# EAGLE design ArdSensor (EAGLE 7.1.0)
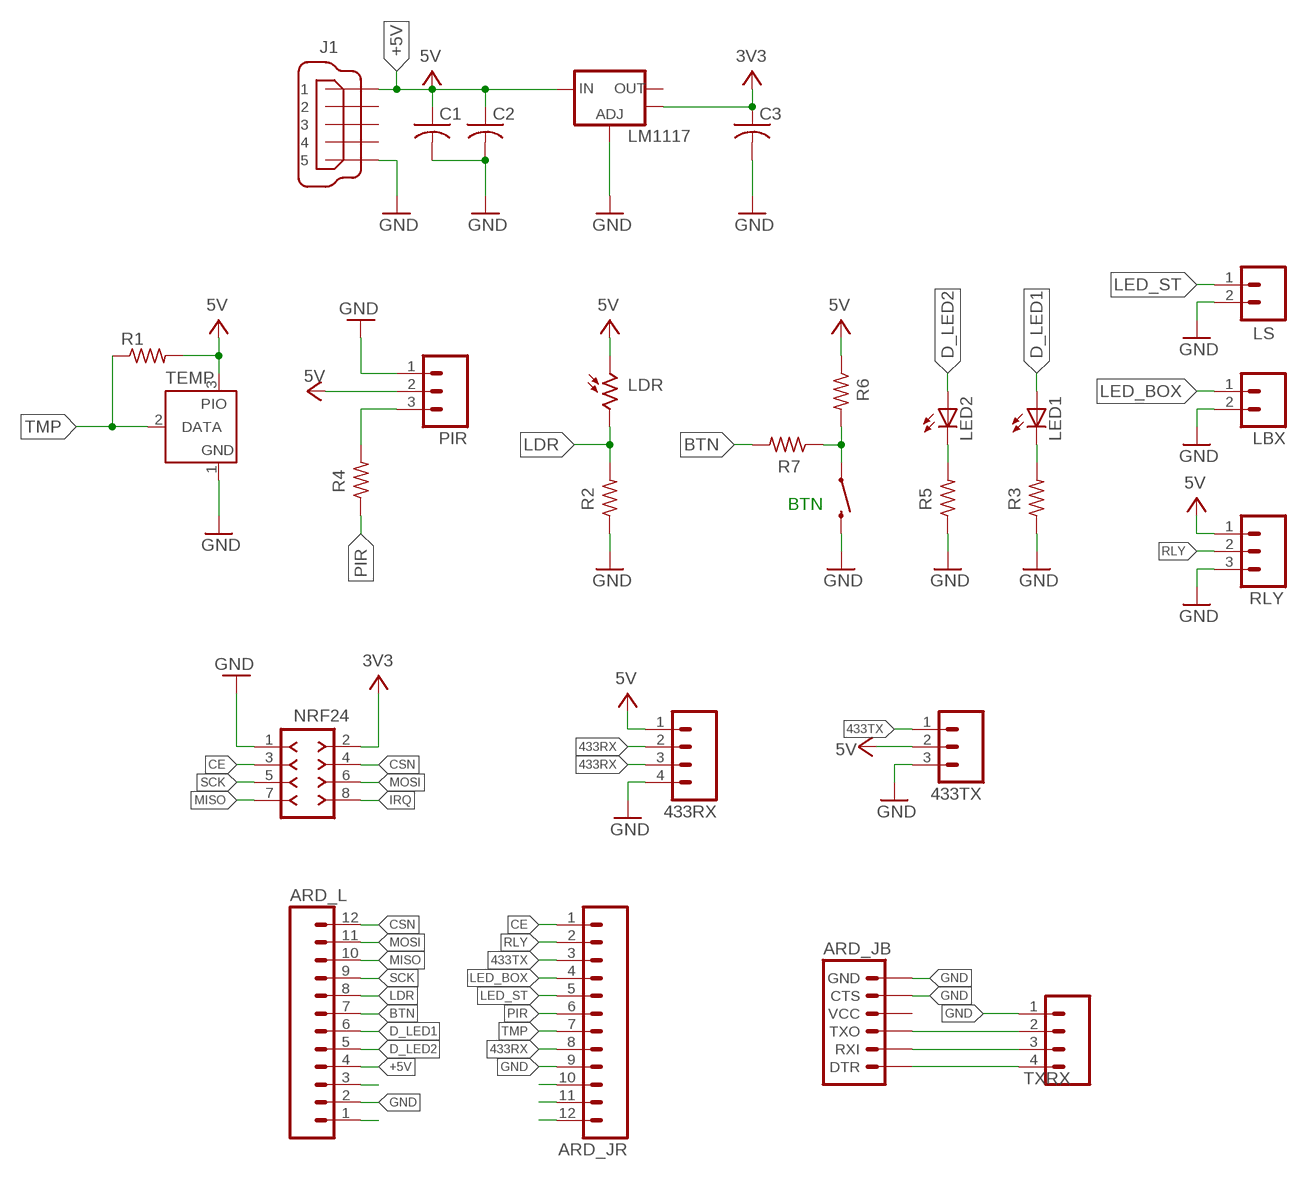
[diagram p0: schematic, sheet 1]

## Parts
433RX  M04PTH  [1X04]
433TX  M03PTH  [1X03]
ARD_JB  ARDUINO_SERIAL_PROGRAMPTH  [1X06]
ARD_JR  M12PTH  [1X12]
ARD_L  M12PTH  [1X12]
BTN  SWITCH-MOMENTARY-2SMD-1101NE  [TACTILE-SWITCH-1101NE]
C1  C-USC0805  [C0805]
C2  C-USC0805  [C0805]
C3  C-USC0805  [C0805]
J1  MICRO-USB-ZX62R-B-5P  [ZX62R-B-5P]
LBX  M02PTH  [1X02]
LDR  D11  [BPX65]
LED1  LEDCHIPLED_0805  [CHIPLED_0805]
LED2  LEDCHIPLED_0805  [CHIPLED_0805]
LM1117  V_REG_LM1117SOT223  [SOT223]
LS  M02PTH  [1X02]
NRF24  F-2X04-DIL-100  [DIL-100-2X04]
PIR  M03PTH  [1X03]
R1  R-US_R0805  [R0805]
R2  R-US_R0805  [R0805]
R3  R-US_R0805  [R0805]
R4  R-US_R0805  [R0805]
R5  R-US_R0805  [R0805]
R6  R-US_R0805  [R0805]
R7  R-US_R0805  [R0805]
RLY  M03PTH  [1X03]
TEMP  DS2405  [TO92-]
TXRX  M04PTH  [1X04]

## Nets
433RX: 433RX.2 433RX.3 ARD_JR.8
433TX: 433TX.1 ARD_JR.3
+3V3: C3.1 LM1117.4(OUT) NRF24.2 ; supply symbol labelled 3V3
+5V: 433RX.1 433TX.2 ARD_L.4 C1.1 C2.1 J1.1 LDR.A LM1117.3(IN) PIR.2 R1.2 R6.1 RLY.1 TEMP.3(PIO) ; supply symbol labelled 5V
BTN: ARD_L.7 R7.2
CE: ARD_JR.1 NRF24.3
CSN: ARD_L.12 NRF24.4
D_LED1: ARD_L.6 LED1.A
D_LED2: ARD_L.5 LED2.A
GND: 433RX.4 433TX.3 ARD_JB.5(CTS) ARD_JB.6(GND) ARD_JR.9 ARD_L.2 BTN.2 C1.2 C2.2 C3.2 J1.5 LBX.2 LM1117.1(ADJ) LS.2 NRF24.1 PIR.1 R2.1 R3.1 R5.1 RLY.3 TEMP.1(GND) TXRX.1
IRQ: NRF24.8
LDR: ARD_L.8 LDR.K R2.2
LED_BOX: ARD_JR.4 LBX.1
LED_ST: ARD_JR.5 LS.1
MISO: ARD_L.10 NRF24.7
MOSI: ARD_L.11 NRF24.6
N$2: LED2.C R5.2
N$3: LED1.C R3.2
N$5: PIR.3 R4.2
N$8: BTN.1 R6.2 R7.1
N$9: ARD_JB.3(TXO) TXRX.2
N$11: ARD_JB.2(RXI) TXRX.3
N$13: ARD_JB.1(DTR) TXRX.4
N$15: ARD_JR.10
N$16: ARD_JR.11
N$17: ARD_JR.12
N$49: ARD_L.3
N$51: ARD_L.1
PIR: ARD_JR.6 R4.1
RLY: ARD_JR.2 RLY.2
SCK: ARD_L.9 NRF24.5
TMP: ARD_JR.7 R1.1 TEMP.2(DATA)
Unconnected: ARD_JB.4(VCC) J1.2 J1.3 J1.4 LM1117.2(OUT)

## Library data of the parts
433RX TXRX = SparkFun-Connectors:M04: Header 4 Standard 4-pin 0.1" header. Use with straight break away headers (SKU : PRT-00116), right angle break away headers (PRT-00553), swiss pins (PRT-00743), machine pins (PRT-00117), and female headers (PRT-00115). Molex polarized connector foot print use with SKU : PRT-08231 with associated crimp pins and housings. 1MM SMD Version SKU: PRT-10208
433TX PIR RLY = SparkFun-Connectors:M03: Header 3 Standard 3-pin 0.1" header. Use with straight break away headers (SKU : PRT-00116), right angle break away headers (PRT-00553), swiss pins (PRT-00743), machine pins (PRT-00117), and female headers (PRT-00115). Molex polarized connector foot print use with SKU : PRT-08232 with associated crimp pins and housings.
ARD_JB = SparkFun-Connectors:ARDUINO_SERIAL_PROGRAM: FTDI connector footprints
ARD_JR ARD_L = SparkFun-Connectors:M12: Header 12 Standard 12-pin 0.1" header. Use with straight break away headers (SKU : PRT-00116), right angle break away headers (PRT-00553), swiss pins (PRT-00743), machine pins (PRT-00117), and female headers (PRT-00115).
BTN = sparkFun-Electromechanical:SWITCH-MOMENTARY-2: Various NO switches- pushbuttons, reed, etc; PROD_ID: SWCH-00815
C1-C3 = adafruit:C-US: CAPACITOR, American symbol
J1 = con-hirose2:MICRO-USB-: Hirose Micro USB Connector ZX62R-B-5P: Micro B, reverse (top mount) shell SMT Supplier: DigiKey H11574CT-ND Source: http://www.hirose.co.jp/cataloge_hp/e24200011.pdf
LBX LS = SparkFun-Connectors:M02: Standard 2-pin 0.1" header. Use with - straight break away headers ( PRT-00116) - right angle break away headers (PRT-00553) - swiss pins (PRT-00743) - machine pins (PRT-00117) - female headers (PRT-00115) Molex polarized connector foot print use with: PRT-08233 with associated crimp pins and housings. 2.54_SCREWTERM for use with PRT-10571. 3.5mm Screw Terminal footprints for PRT-08084 5mm Screw Terminal footprints for use with PRT-08432
LDR = APC:D11: Photo Sensor Oil Burner Control Applications Source: http://optoelectronics.perkinelmer.com/content/Datasheets/DTS_PhotocellsD1160.pdf
LED1 LED2 = led:LED: LED OSRAM: - CHIPLED LG R971, LG N971, LY N971, LG Q971, LY Q971, LO R971, LY R971 LH N974, LH R974 LS Q976, LO Q976, LY Q976 LO Q996 - Hyper CHIPLED LW Q18S LB Q993, LB Q99A, LB R99A - SideLED LS A670, LO A670, LY A670, LG A670, LP A670 LB A673, LV A673, LT A673, LW A673 LH A674 LY A675 LS A676, LA A676, LO A676, LY A676, LW A676 LS A679, LY A679, LG A679 - Hyper Micro SIDELED® LS Y876, LA Y876, LO Y876, LY Y876 LT Y87S - SmartLED LW L88C, LW L88S LB L89C, LB L89S, LG L890 LS L89K, LO L89K, LY L89K LS L896, LA L896, LO L896, LY L896 - TOPLED LS T670, LO T670, LY T670, LG T670, LP T670 LSG T670, LSP T670, LSY T670, LOP T670, LYG T670 LG T671, LOG T671, LSG T671 LB T673, LV T673, LT T673, LW T673 LH T674 LS T676, LA T676, LO T676, LY T676, LB T676, LH T676, LSB T676, LW T676 LB T67C, LV T67C, LT T67C, LS T67K, LO T67K, LY T67K, LW E67C LS E67B, LA E67B, LO E67B, LY E67B, LB E67C, LV E67C, LT E67C LW T67C LS T679, LY T679, LG T679 LS T770, LO T770, LY T770, LG T770, LP T770 LB T773, LV T773, LT T773, LW T773 LH T774 LS E675, LA E675, LY E675, LS T675 LS T776, LA T776, LO T776, LY T776, LB T776 LHGB T686 LT T68C, LB T68C - Hyper Mini TOPLED® LB M676 - Mini TOPLED Santana® LG M470 LS M47K, LO M47K, LY M47K Source: http://www.osram.convergy.de LUXEON: - LUMILED® LXK2-PW12-R00, LXK2-PW12-S00, LXK2-PW14-U00, LXK2-PW14-V00 LXK2-PM12-R00, LXK2-PM12-S00, LXK2-PM14-U00 LXK2-PE12-Q00, LXK2-PE12-R00, LXK2-PE12-S00, LXK2-PE14-T00, LXK2-PE14-U00 LXK2-PB12-K00, LXK2-PB12-L00, LXK2-PB12-M00, LXK2-PB14-N00, LXK2-PB14-P00, LXK2-PB14-Q00 LXK2-PR12-L00, LXK2-PR12-M00, LXK2-PR14-Q00, LXK2-PR14-R00 LXK2-PD12-Q00, LXK2-PD12-R00, LXK2-PD12-S00 LXK2-PH12-R00, LXK2-PH12-S00 LXK2-PL12-P00, LXK2-PL12-Q00, LXK2-PL12-R00 Source: www.luxeon.com KINGBRIGHT: KA-3528ASYC Source: www.kingbright.com
LM1117 = SparkFun-PowerIC:V_REG_LM1117: Voltage Regulator LM1117 Standard adjustable voltage regulator but in SMD form. Spark Fun Electronics SKU : COM-00595; PROD_ID: VREG-08170
NRF24 = con-headers-jp:F-2X04-: FEMALE HEADER
R1-R7 = resistor:R-US_: RESISTOR, American symbol
TEMP = maxim:DS2405: Addressable Switch DALLAS Semiconductor; MF: DALLAS SEMICONDUCTOR; MPN: DS2405; OC_FARNELL: 1188025; OC_NEWARK: 06F4645

## Board
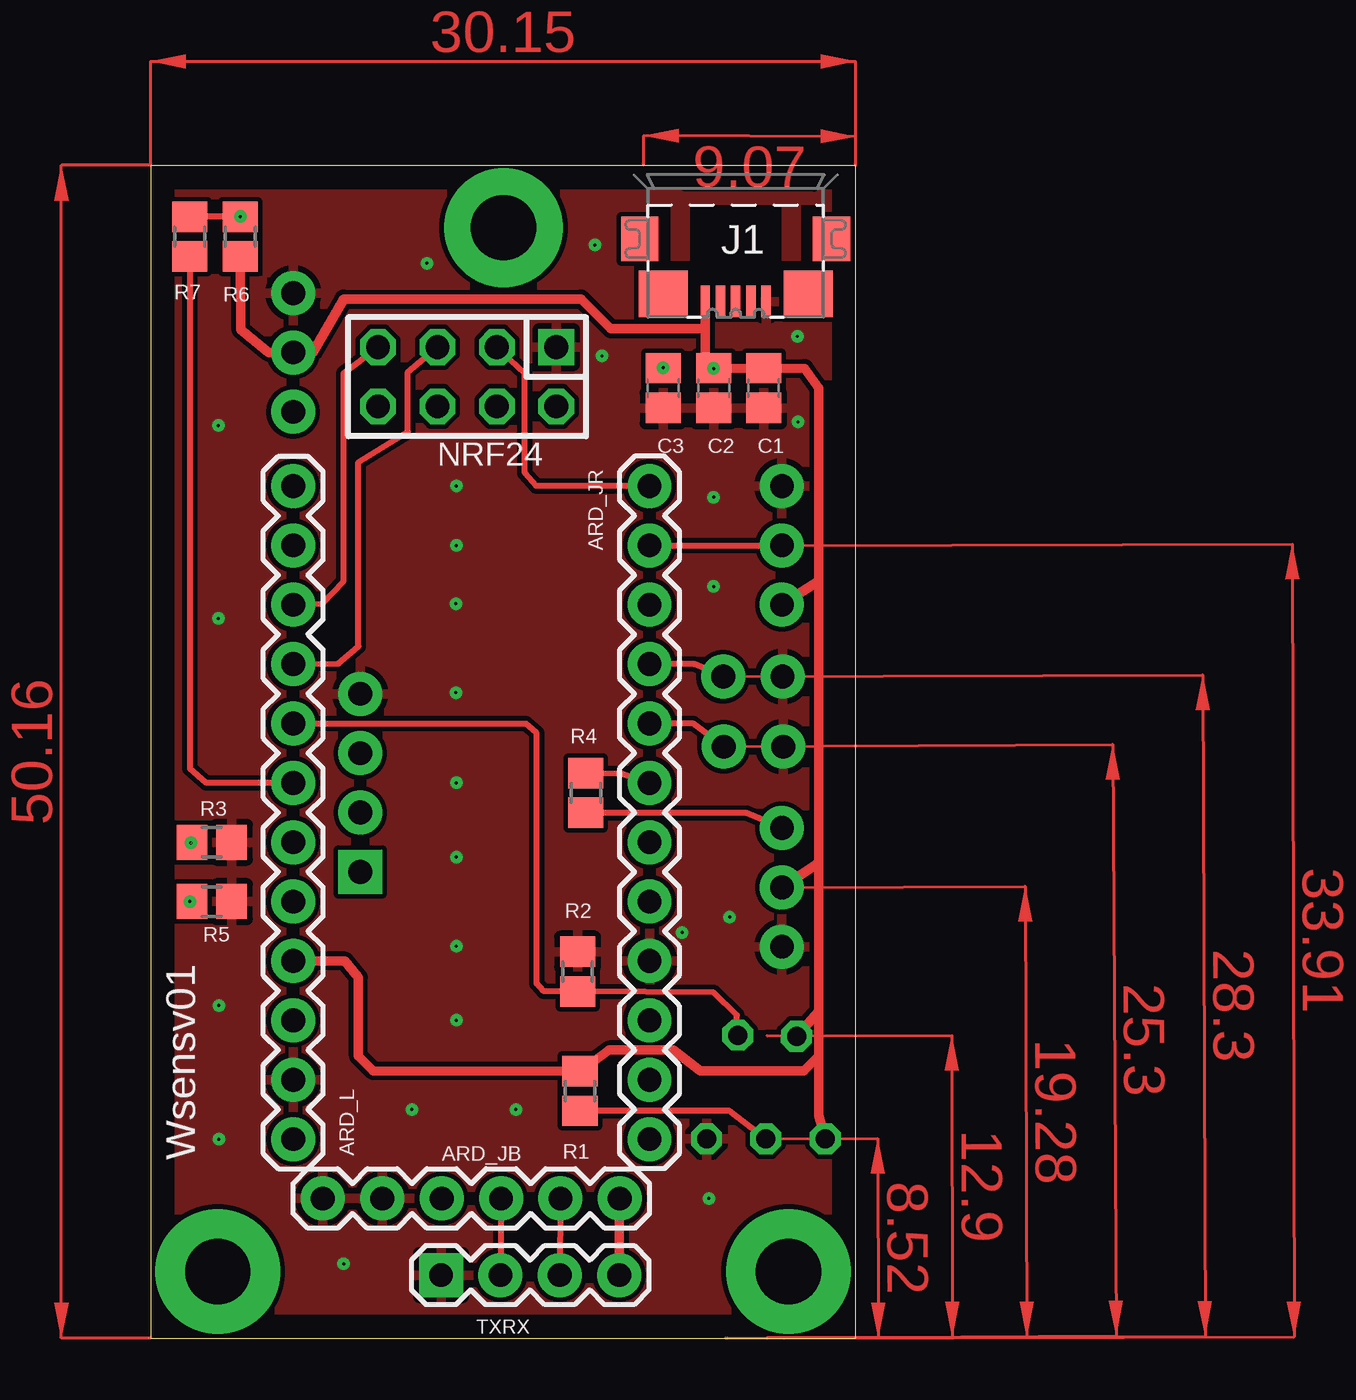
[diagram p1: board, top side]
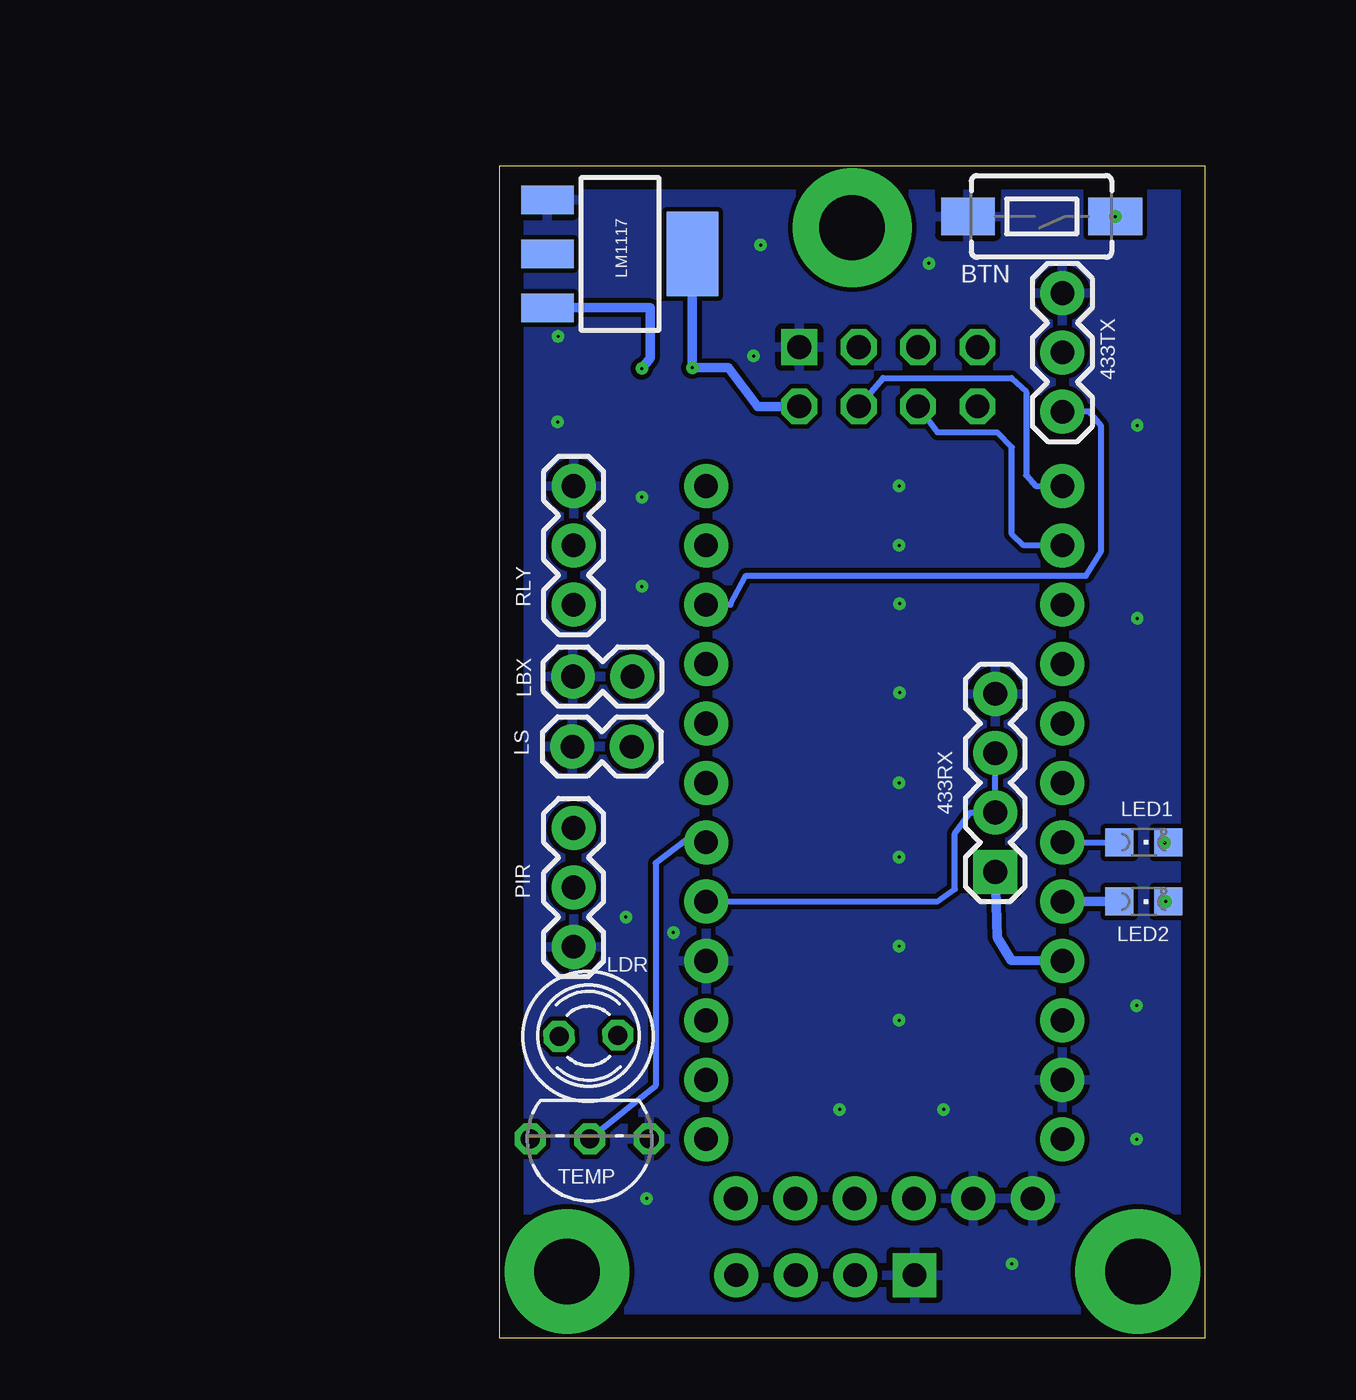
[diagram p2: board, bottom side, seen from below]

Size 30.15 x 50.16 mm. Coordinates in mm from the lower left corner, seen from the top.
Outline: 0,0 30.15,0 30.15,50.16 0,50.16 0,0
Copper layers (1*16): Top 0.035mm / dielectric 1.5mm / Bottom 0.035mm
Design rules "default": minimum track width 10mil, minimum drill 24mil, track to track 8mil, track to pad 8mil, pad to pad 8mil, via to via 8mil, smd to smd 8mil, copper to edge 40mil, drill to drill 8mil, minimum pad ring 10mil, minimum via ring 8mil, stop-mask expansion 4mil, vias tented up to drill 0mil, thermal gap 10mil

### Footprints (pad centres in the part's own frame; a part is rotated, then mirrored left to right if it is on the bottom)
1X04 = drill 1.016 pad 1.88 square: 1 0,0 | drill 1.016 pad 1.88: 2 2.54,0; 3 5.08,0; 4 7.62,0
1X03 = drill 1.016 pad 1.88: 1 0,0; 2 2.54,0; 3 5.08,0
1X06 = drill 1.016 pad 1.88: 1 0,0; 2 2.54,0; 3 5.08,0; 4 7.62,0; 5 10.16,0; 6 12.7,0
1X12 = drill 1.016 pad 1.88: 1 0,0; 2 2.54,0; 3 5.08,0; 4 7.62,0; 5 10.16,0; 6 12.7,0; 7 15.24,0; 8 17.78,0; 9 20.32,0; 10 22.86,0; 11 25.4,0; 12 27.94,0
TACTILE-SWITCH-1101NE = smd 2.3 x 1.6: 1 -3.15,0; 2 3.15,0
C0805 = smd 1.3 x 1.5: 1 -0.85,0; 2 0.85,0
ZX62R-B-5P = smd 1.35 x 0.4: 1 2.675,-1.3; 2 2.675,-0.65; 3 2.675,0; 4 2.675,0.65; 5 2.675,1.3 | smd 1.9 x 1.6: M1 0,-4.1; M2 0,4.1 | smd 2 x 2.1: M3 2.35,3.1; M4 2.35,-3.1
1X02 = drill 1.016 pad 1.88: 1 0,0; 2 2.54,0
BPX65 = drill 0.813 octagon: A -0.889,-0.889; K 0.889,0.889
CHIPLED_0805 = smd 1.2 x 1.2: A 0,-1.05; C 0,1.05
SOT223 = smd 1.219 x 2.235: 1 -2.311,-3.099; 2 0,-3.099; 3 2.311,-3.099 | smd 3.6 x 2.2: 4 0,3.099
DIL-100-2X04 = drill 1.016 square: 1 -3.81,-1.27 | drill 1.016 octagon: 2 -3.81,1.27; 3 -1.27,-1.27; 4 -1.27,1.27; 5 1.27,-1.27; 6 1.27,1.27; 7 3.81,-1.27; 8 3.81,1.27
R0805 = smd 1.3 x 1.5: 1 -0.85,0; 2 0.85,0
TO92- = drill 0.813 octagon: 1 -2.54,0; 2 0,0; 3 2.54,0

### Placement (x,y rotation side)
433RX  8.97,19.94 90 bottom
433TX  6.1,39.62 90 bottom
ARD_JB  20.07,5.97 180 top
ARD_JR  21.34,36.45 270 top
ARD_L  6.1,8.51 90 top
BTN  6.99,47.98 180 bottom
C1  26.21,40.64 270 top
C2  24.08,40.64 270 top
C3  21.92,40.64 270 top
J1  25.02,47.02 270 top
LBX  24.49,28.3 180 bottom
LDR  26.37,12.93 316 bottom
LED1  2.62,21.21 270 bottom
LED2  2.62,18.67 270 bottom
LM1117  25.02,46.38 270 bottom
LS  24.51,25.3 180 bottom
NRF24  13.54,41.12 180 top
PIR  27,16.74 90 bottom
R1  18.36,10.57 90 top
R2  18.26,15.67 270 top
R3  2.62,21.21 180 top
R4  18.62,23.32 270 top
R5  2.62,18.67 180 top
R6  3.84,47.12 90 top
R7  1.68,47.12 270 top
RLY  27,31.37 90 bottom
TEMP  26.31,8.52 180 bottom
TXRX  12.42,2.69 0 top

### Tracks (layer width: path | path; a pad name or v marks a point on that pad's centre or on a via)
433RX
  Bottom 0.254: ARD_JR.8 11.46,18.67 10.69,19.2 10.69,21.59 10.03,22.48 433RX.2 433RX.3
433TX
  Bottom 0.254: ARD_JR.3 20.3,31.37 19.63,32.61 5.08,32.61 4.45,33.66 4.45,39.01 4.95,39.62 433TX.1
+3V3  (via drill 0.13 pad 0)
  Top 0.406: v21.92,41.5 C3.1
  Bottom 0.406: LM1117.4 v21.92,41.5 20.4,41.5 19.13,39.85 NRF24.2
+5V  (via drill 0.13 pad 0.25)
  Top 0.406: v24.08,41.48 C1.1 27.96,41.48 28.57,40.64 28.57,32.38 | v24.08,41.48 C2.1 23.72,42.01 J1.1 | 28.57,20.32 28.57,13.97 | PIR.2 28.57,20.32 | 28.57,32.38 28.57,20.32 | 28.57,13.97 LDR.A | RLY.1 28.57,32.38 | 28.57,13.97 28.57,12.06 | 28.57,12.06 28.57,9.53 TEMP.3 | ARD_L.4 8.31,16.13 8.89,15.42 8.89,12.06 9.53,11.43 R1.2 19.61,12.32 22.35,12.32 23.5,11.43 27.94,11.43 28.57,12.06 | v24.08,41.48 23.72,41.91 23.72,43.18 19.68,43.18 18.41,44.45 8.26,44.45 6.93,42.16 433TX.2 5.05,42.16 3.86,43.13 R6.1
  Bottom 0.406: LM1117.3 23.72,44.07 23.72,41.91 v24.08,41.48 | ARD_L.4 8.28,16.15 8.89,17.14 433RX.1
BTN
  Top 0.254: R7.2 1.68,24.36 2.39,23.75 ARD_L.7
CE
  Top 0.254: ARD_JR.1 16.48,36.45 16,37.01 16,41.27 NRF24.3
CSN
  Bottom 0.254: ARD_L.12 7.24,36.45 7.64,36.91 7.64,40.49 8.28,41.07 13.77,41.07 NRF24.4
D_LED1
  Bottom 0.254: ARD_L.6 LED1.A
D_LED2
  Bottom 0.406: ARD_L.5 LED2.A
GND  (via drill 0.13)
  other vias: 27.66,42.85 15.62,9.78 8.26,3.17 2.92,14.22 13.08,36.45 27.69,39.19 19.3,42.01 19,46.76 13.08,16.76 22.73,17.35 2.9,30.78 24.77,18.01 23.88,5.97 13.08,20.57 24.08,35.97 24.08,32.16 11.81,45.97 2.9,39.04 13.06,31.42 13.08,23.75 13.08,13.59 11.18,9.78 2.92,8.51 13.06,27.61 13.08,33.91
  pour Bottom: -17.78,66.67 53.98,67.31 53.98,-13.34 -17.78,-13.97
  pour Top: -15.88,64.14 52.7,64.14 52.7,-12.7 -15.88,-12.7
LDR
  Top 0.254: LDR.K 25.07,13.82 24.08,14.78 R2.2 16.82,14.83 16.51,15.16 16.51,25.88 16.05,26.29 ARD_L.8
LED_BOX
  Top 0.254: LBX.1 23.24,28.83 ARD_JR.4
LED_ST
  Top 0.254: LS.1 23.22,26.29 ARD_JR.5
MISO
  Top 0.254: ARD_L.10 7.34,31.42 8.26,32.38 8.26,41.27 NRF24.7
MOSI
  Bottom 0.254: ARD_L.11 7.75,33.91 8.26,34.39 8.26,38.1 8.89,38.73 11.43,38.73 NRF24.6
N$1  (via drill 2.79 pad 5.08)
  other vias: 15.09,47.5
N$2  (via drill 0.13 pad 0.25)
  Top 0.254: R5.2 v1.68,18.67
  Bottom 0.254: v1.68,18.67 LED2.C
N$3  (via drill 0.13 pad 0.25)  (1 unrouted)
  Bottom 0.254: LED1.C v1.73,21.18
N$4  (via drill 2.79 pad 5.33)
  other vias: 27.28,2.84
N$5
  Top 0.254: PIR.3 25.48,22.45 R4.2
N$7  (via drill 2.79 pad 5.33)
  other vias: 2.87,2.84
N$8  (via drill 0.13 pad 0.25)
  Top 0.254: BTN.1 R6.2 R7.1
  Bottom 0.254: BTN.1
  other vias: 3.84,47.98
N$9
  Top 0.254: ARD_JB.3 TXRX.2
N$11
  Top 0.254: ARD_JB.2 TXRX.3
N$13
  Top 0.406: ARD_JB.1 20.04,5.97 TXRX.4
PIR
  Top 0.254: R4.1 20.14,24.16 ARD_JR.6
RLY
  Top 0.254: ARD_JR.2 RLY.2
SCK
  Top 0.254: ARD_L.9 8.03,28.85 8.89,29.59 8.89,37.47 11,38.79 11,41.33 NRF24.5
TMP
  Top 0.254: R1.1 24.74,9.73 TEMP.2
  Bottom 0.254: TEMP.2 23.5,10.79 23.5,20.32 22.23,21.29 ARD_JR.7
(copper drawn outside any net)
  shapes: Top area x9

### Text on the board
tNames: Wsensv01